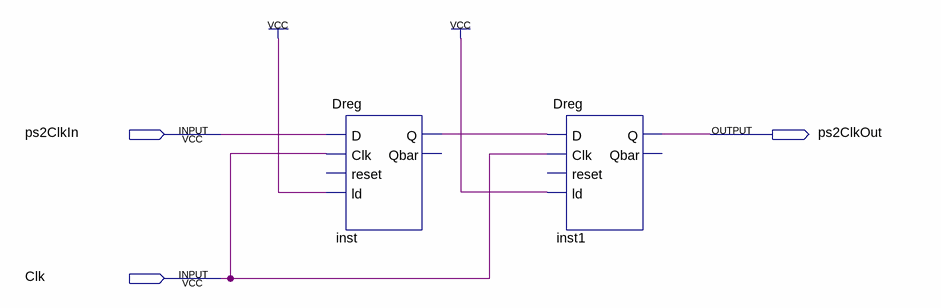
[diagram p0: schematic sheet]
// Quartus schematic ps2ClockDivider.bdf as structural Verilog: 2 symbols, 3 pins
module ps2ClockDivider (
  input  ps2ClkIn,
  input  Clk,
  output ps2ClkOut
);

  wire inst_q;

  Dreg inst (.D(ps2ClkIn), .Clk(Clk), .ld(1'b1), .Q(inst_q));  // open: reset, Qbar
  Dreg inst1 (.D(inst_q), .Clk(Clk), .ld(1'b1), .Q(ps2ClkOut));  // open: reset, Qbar
endmodule
